# EAGLE design 4069 fuzz pedal (EAGLE 9.6.2)
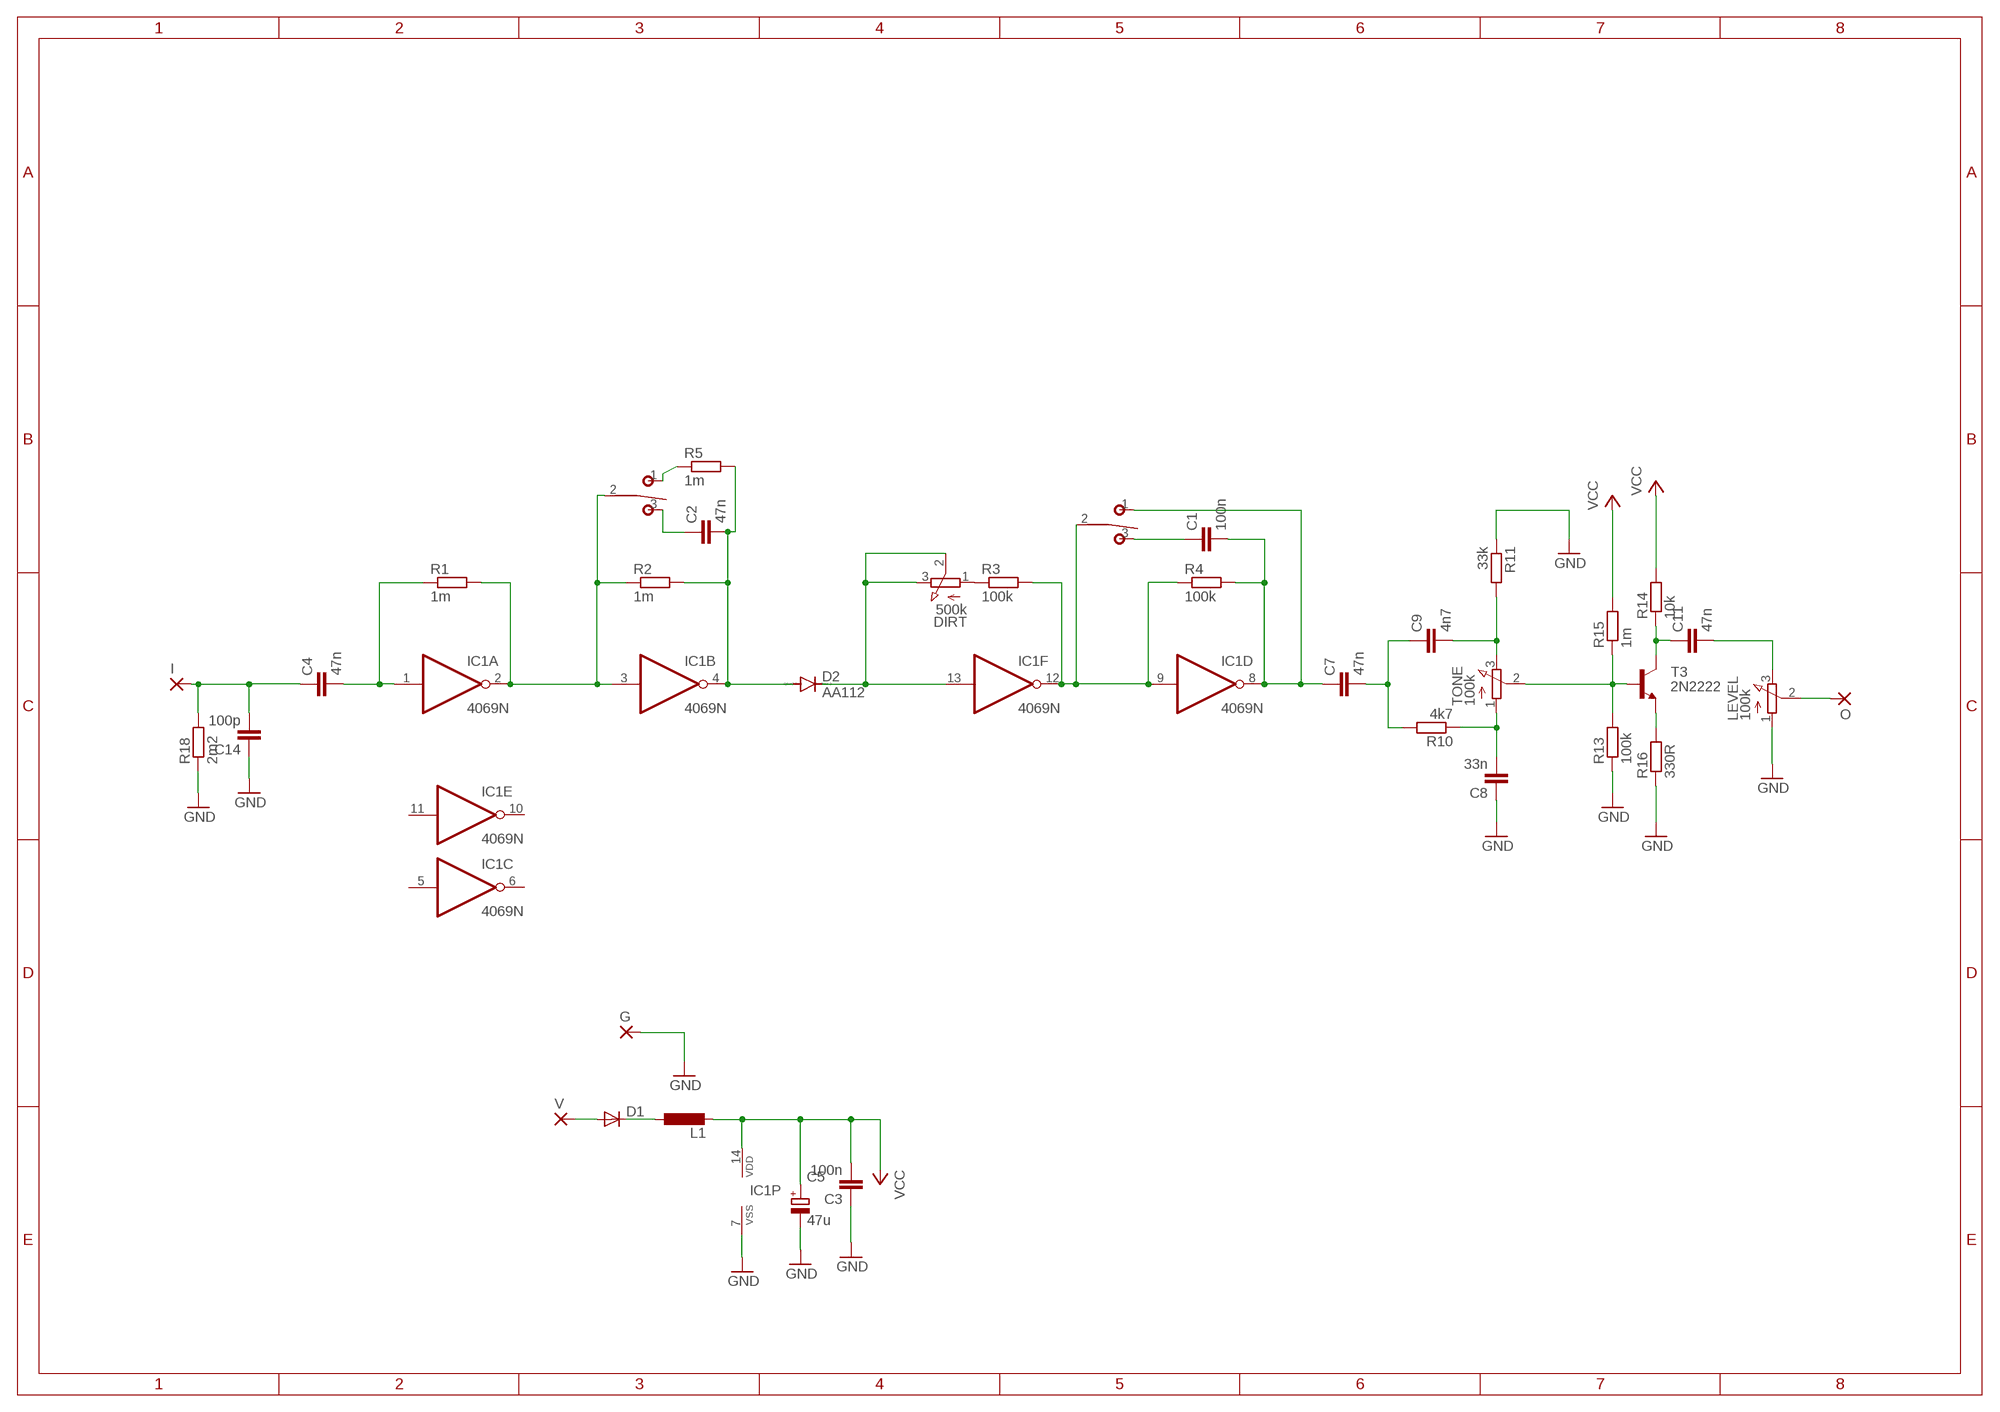
[diagram p0: schematic, sheet 1]

## Parts
C1  100n  C5/2.5  [C5B2.5]
C2  47n  C5/2.5  [C5B2.5]
C3  100n  C5/2.5  [C5B2.5]
C4  47n  C5/2.5  [C5B2.5]
C5  47u  CPOL-EUE2-4  [E2-4]
C7  47n  C5/2.5  [C5B2.5]
C8  33n  C5/2.5  [C5B2.5]
C9  4n7  C5/2.5  [C5B2.5]
C11  47n  C5/2.5  [C5B2.5]
C14  100p  C5/2.5  [C5B2.5]
D1  SMALL_DIODEDO35-7  [DO35-7]
D2  AA112  [DO07]
DIRT  500k  HEXPOT1  [3RP/1610N]
G  2,15/1,0  [2,15/1,0]
I  2,15/1,0  [2,15/1,0]
IC1  4069N  [DIL14]
L1  L-EU0204/7  [0204/7]
LEVEL  100k  HEXPOT1  [3RP/1610N]
O  2,15/1,0  [2,15/1,0]
R1  1m  R-EU_0207/7  [0207/7]
R2  1m  R-EU_0207/7  [0207/7]
R3  100k  R-EU_0207/7  [0207/7]
R4  100k  R-EU_0207/7  [0207/7]
R5  1m  R-EU_0207/7  [0207/7]
R10  4k7  R-EU_0207/7  [0207/7]
R11  33k  R-EU_0207/7  [0207/7]
R13  100k  R-EU_0207/7  [0207/7]
R14  10k  R-EU_0207/7  [0207/7]
R15  1m  R-EU_0207/7  [0207/7]
R16  330R  R-EU_0207/7  [0207/7]
R18  2m2  R-EU_0207/7  [0207/7]
T3  2N2222  [TO18]
TONE  100k  HEXPOT1  [3RP/1610N]
U$1  T-80-T-SPDT-ON-OFF-ON  [M9040P]
U$2  T-80-T-SPDT-ON-OFF-ON  [M9040P]
V  2,15/1,0  [2,15/1,0]

## Nets
GND: C3.1 C5.- C8.1 C14.1 G.1(P) IC1.7(P:VSS) LEVEL.1(A) R11.1 R13.1 R16.1 R18.1
N$1: C2.2 D2.A IC1.4(B:O) R2.2 R5.2
N$2: IC1.2(A:O) IC1.3(B:I) R1.2 R2.1 U$2.2(P)
N$3: DIRT.1(A) R3.1
N$4: IC1.9(D:I) IC1.12(F:O) R3.2 R4.1 U$1.2(P)
N$5: D2.C DIRT.2(S) DIRT.3(E) IC1.13(F:I)
N$6: C4.2 IC1.1(A:I) R1.1
N$7: C2.1 U$2.3(S)
N$8: C4.1 C14.2 I.1(P) R18.2
N$9: R5.1 U$2.1(O)
N$10: C1.1 U$1.3(S)
N$11: D1.C L1.1
N$12: D1.A V.1(P)
N$13: C9.2 R11.2 TONE.3(E)
N$16: C8.2 R10.1 TONE.1(A)
N$17: C7.2 C9.1 R10.2
N$19: R13.2 R15.1 T3.2(B) TONE.2(S)
N$20: C11.1 R14.1 T3.3(C)
N$21: R16.2 T3.1(E)
N$22: LEVEL.2(S) O.1(P)
N$23: C11.2 LEVEL.3(E)
N$25: C1.2 C7.1 IC1.8(D:O) R4.2 U$1.1(O)
VCC: C3.2 C5.+ IC1.14(P:VDD) L1.2 R14.2 R15.2
Unconnected: IC1.5(C:I) IC1.6(C:O) IC1.10(E:O) IC1.11(E:I)

## Library data of the parts
C1-C4 C7-C9 C11 C14 = hexcapacitor-wima:C: CAPACITOR naming: grid - package width
C5 = rcl:CPOL-EU: POLARIZED CAPACITOR, European symbol; SPICEPREFIX: C
D1 = MusicThingModular:SMALL_DIODE: Small Signal Diode
D2 = diode:AA112: DIODE germanium
DIRT LEVEL TONE = hexpedalpot:HEXPOT1: 16mm Potentiometer one level Source: http://www.alphapotentiometers.net/html/16mm_pot_2.html
G I O V = wirepad:2,15/1,0: THROUGH-HOLE PAD
IC1 = 40xx:4069: Hex INVERTER
L1 = hexresistor:L-EU: INDUCTOR, European symbol; SPICEPREFIX: L
R1-R5 R10 R11 R13-R16 R18 = hexresistor:R-EU_: RESISTOR, European symbol; SPICEPREFIX: R
T3 = transistor:2N2222: NPN TRANSISTOR
U$1 U$2 = MusicThingModular:T-80-T-SPDT-ON-OFF-ON

## Net classes
0 default: width 0.203 mm

## Board
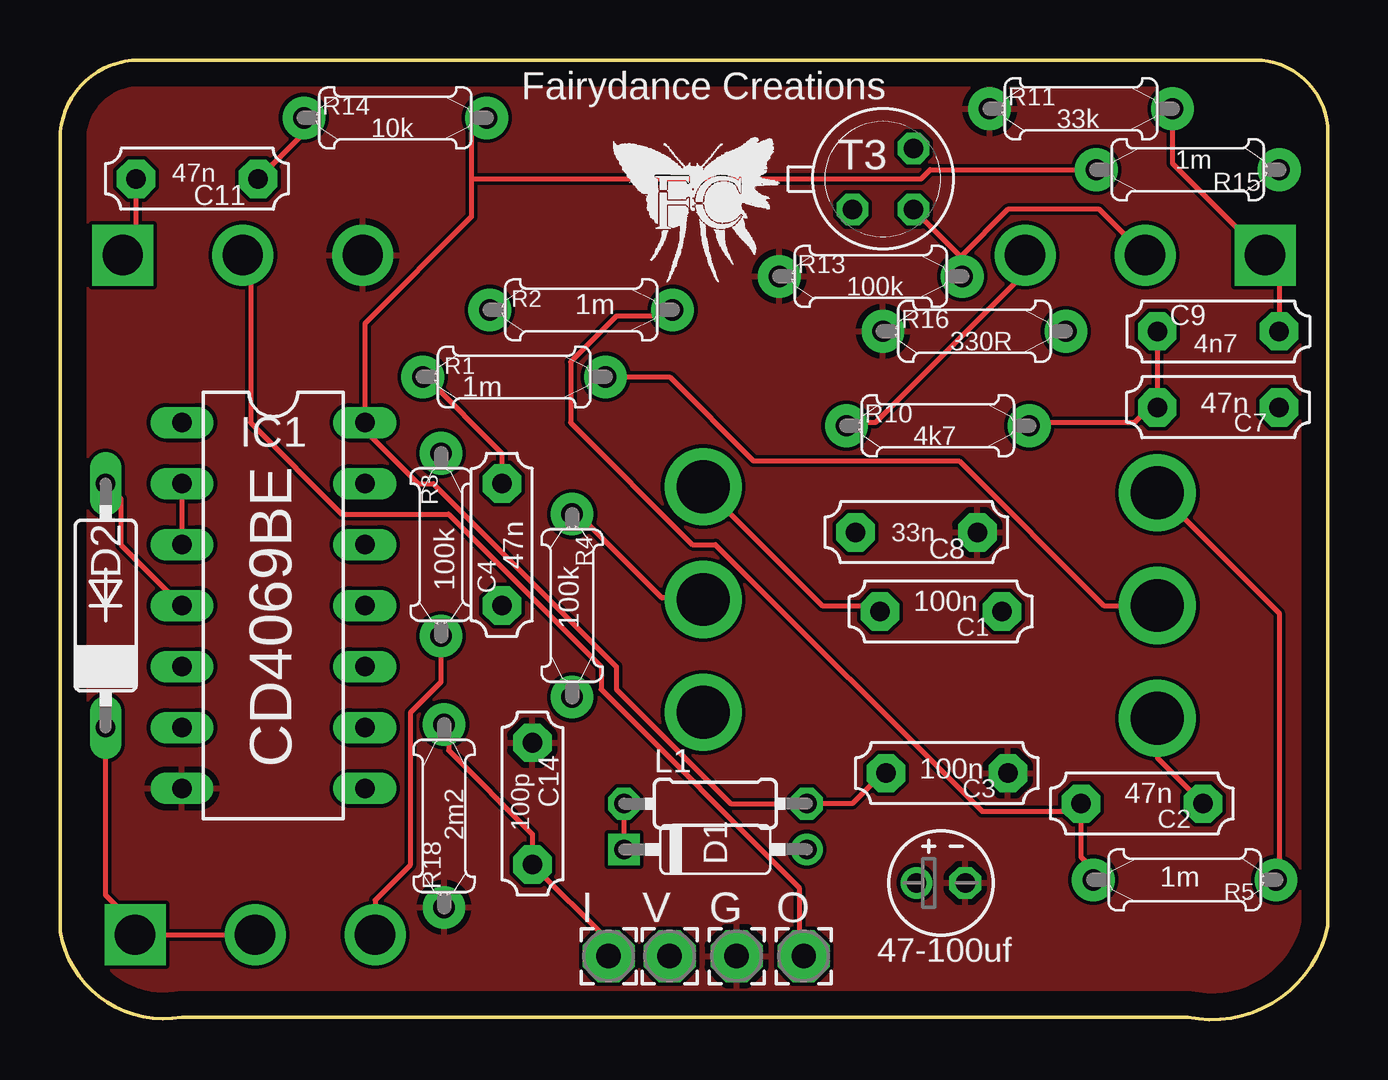
[diagram p1: board, top side]
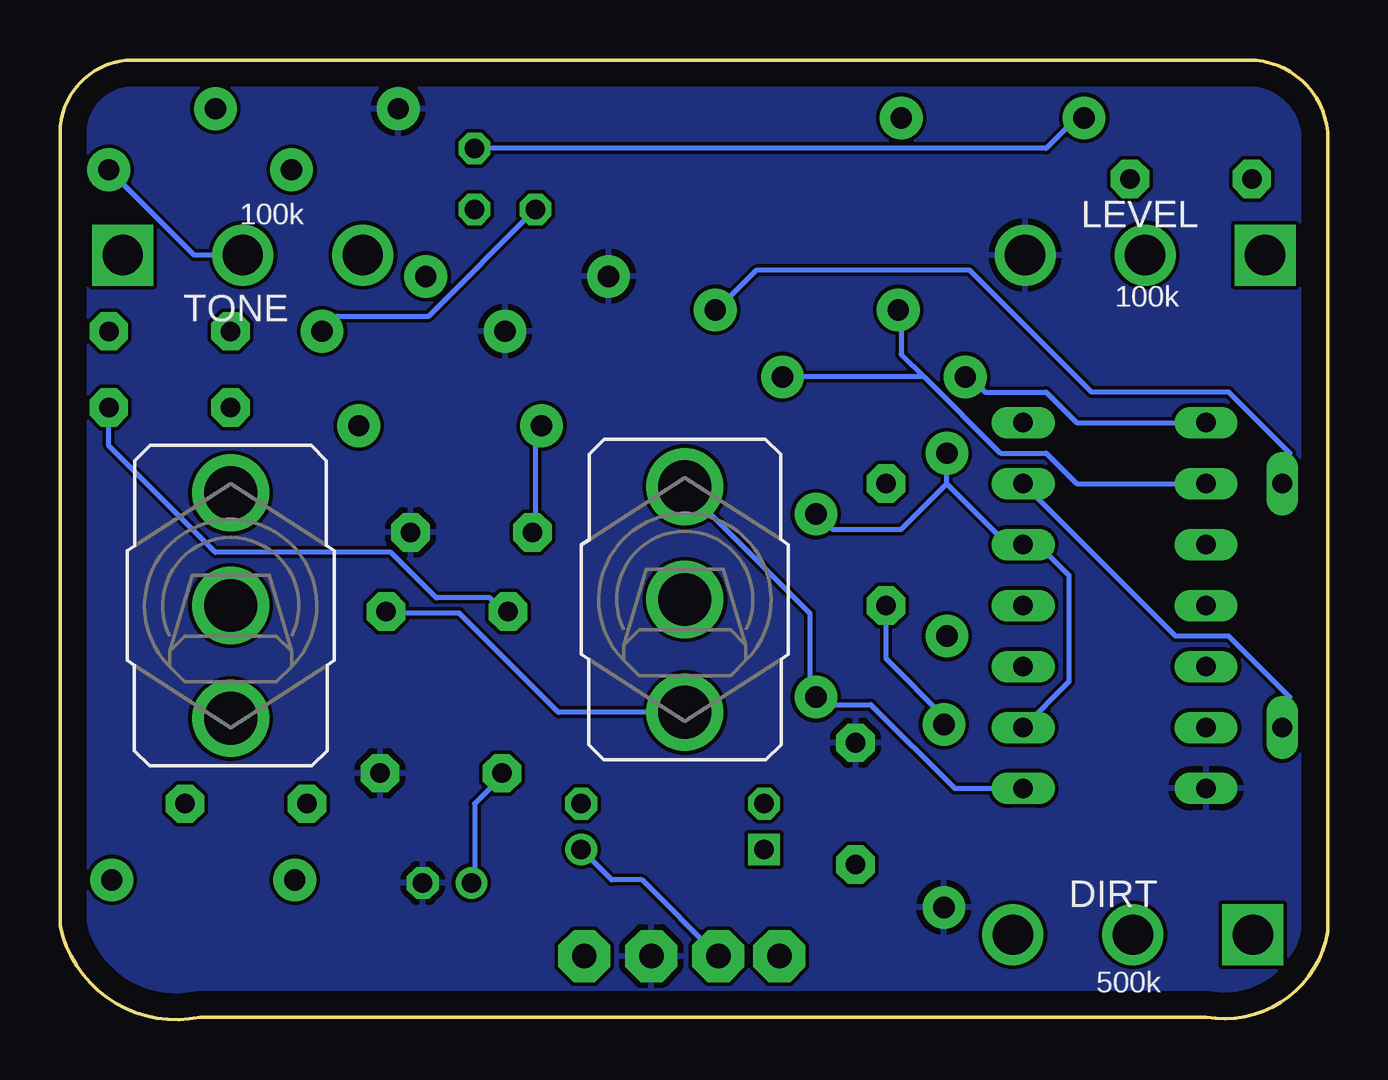
[diagram p2: board, bottom side, seen from below]

Size 52.83 x 39.98 mm. Coordinates in mm from the lower left corner, seen from the top.
Outline: 0,36.68 0,3.66 arc90 5.08,0.1 46.99,0.1 arc90 52.83,3.91 52.83,36.93 arc90 49.78,39.98 3.3,39.98 arc90 0,36.68
Copper layers (1*16): Top 0.035mm / dielectric 1.5mm / Bottom 0.035mm
Design rules "default": minimum track width 6mil, minimum drill 0.35mm, track to track 6mil, track to pad 6mil, pad to pad 6mil, via to via 6mil, smd to smd 6mil, copper to edge 40mil, drill to drill 6mil, minimum pad ring 10mil, minimum via ring 8mil, stop-mask expansion 4mil, vias tented up to drill 0mil, thermal gap 10mil

### Footprints (pad centres in the part's own frame; a part is rotated, then mirrored left to right if it is on the bottom)
C5B2.5 = drill 0.813 pad 1.6 octagon: 1 -2.54,0; 2 2.54,0
E2-4 = drill 0.813 pad 1.27: + -1.016,0 | drill 0.813 pad 1.27 octagon: - 1.016,0
DO35-7 = drill 0.813: A 3.81,0 | drill 0.813 square: C -3.81,0
DO07 = drill 0.813 long: A 5.08,0; C -5.08,0
3RP/1610N = drill 1.676 pad 2.54: 1 -5,0; 2 0,0 | drill 1.676 pad 2.54 square: 3 5,0
2,15/1,0 = drill 1.016 pad 2.159 octagon: 1 0,0
DIL14 = drill 0.813 long: 1 -7.62,-3.81; 2 -5.08,-3.81; 3 -2.54,-3.81; 4 0,-3.81; 5 2.54,-3.81; 6 5.08,-3.81; 7 7.62,-3.81; 8 7.62,3.81; 9 5.08,3.81; 10 2.54,3.81; 11 0,3.81; 12 -2.54,3.81; 13 -5.08,3.81; 14 -7.62,3.81
0204/7 = drill 0.813 octagon: 1 -3.81,0; 2 3.81,0
0207/7 = drill 0.889 pad 1.778: 1 -3.81,0; 2 3.81,0
TO18 = drill 0.813 octagon: 1 -1.27,-1.27; 2 1.27,-1.27; 3 1.27,1.27
M9040P = drill 2.2: 1 0,4.699 | drill 2.2 pad 3: 2 0,0; 3 0,-4.699

### Placement (x,y rotation side)
C1  36.7,17 180 top
C2  45.09,8.99 180 top
C3  36.96,10.26 180 top
C4  18.41,19.79 90 top
C5  36.7,5.69 0 top
C7  48.26,25.5 180 top
C8  35.69,20.3 180 top
C9  48.26,28.68 0 top
C11  5.72,35.03 180 top
C14  19.69,8.99 270 top
D1  27.3,7.09 0 top
D2  1.91,17.25 90 top
DIRT  8.13,3.53 0 bottom
G  28.19,2.64 0 top
I  22.86,2.64 0 top
IC1  8.89,17.25 270 top
L1  27.3,8.99 0 top
LEVEL  7.62,31.85 0 bottom
O  30.99,2.64 0 top
R1  18.92,26.77 0 top
R2  21.72,29.57 0 top
R3  15.88,19.79 90 top
R4  21.34,17.25 270 top
R5  46.86,5.82 180 top
R10  36.58,24.74 0 top
R11  42.55,37.95 0 top
R13  33.78,30.97 0 top
R14  13.97,37.57 0 top
R15  46.99,35.41 180 top
R16  38.1,28.68 0 top
R18  16,8.49 90 top
T3  34.29,35.03 0 top
TONE  45.21,31.85 180 bottom
U$1  26.8,17.5 0 bottom
U$2  45.72,17.25 0 bottom
V  25.4,2.64 0 top

### Tracks (layer width: path | path; a pad name or v marks a point on that pad's centre or on a via)
GND
  pour Bottom: -0.84,39.88 -0.84,0.16 52.73,0.16 52.73,39.88
  pour Top: -0.94,0.23 -0.94,39.93 53.44,39.93 53.44,0.23
N$1
  Top 0.203: 42.55,8.68 42.55,6.77 43.5,5.82 R5.2 | IC1.4 2.54,19.79 2.54,21.69 D2.A | 42.55,8.68 38.42,8.68 27.3,19.79 26.35,19.79 21.27,24.87 21.27,27.41 23.18,29.31 25.4,29.31 R2.2 | 42.55,8.68 C2.2
  Bottom 0.203: D2.A 1.59,22.65 1.59,23.6 4.13,26.14 9.84,26.14 14.92,31.22 23.81,31.22 25.4,29.63 R2.2
N$2
  Top 0.203: IC1.2 IC1.3 | U$2.2 43.5,17.25 37.47,23.28 28.89,23.28 25.4,26.77 R1.2
  Bottom 0.203: IC1.2 10.48,22.33 11.75,23.6 13.65,23.6 16.83,26.77 | 16.83,26.77 17.78,27.73 17.78,29.31 R2.1 | 16.83,26.77 R1.2
N$3
  Top 0.203: R3.1 15.88,14.07 14.61,12.8 14.61,6.45 13.13,4.98 DIRT.1
N$4
  Top 0.203: R4.1 21.59,21.06 25.08,17.57 26.67,17.57 U$1.2
  Bottom 0.203: IC1.9 10.8,14.07 10.8,18.52 12.07,19.79 IC1.12 13.34,19.79 15.88,22.33 | 15.88,22.33 R3.2 | 15.88,22.33 17.78,20.42 20.64,20.42 21.27,21.06 R4.1
N$5
  Top 0.203: D2.C 1.91,5.18 3.13,3.96 DIRT.3 DIRT.2
  Bottom 0.203: IC1.13 6.35,15.98 4.13,15.98 1.59,13.44 1.59,12.49 D2.C
N$6
  Top 0.203: C4.2 18.41,23.6 15.24,26.77 R1.1
  Bottom 0.203: IC1.1 10.48,24.87 11.75,26.14 14.29,26.14 14.92,26.77 R1.1
N$7
  Top 0.203: C2.1 45.72,10.9 U$2.3
N$8
  Top 0.203: I.1 22.86,3.28 C14.2 19.69,7.72 16.19,11.22 16.19,12.17 R18.2
  Bottom 0.203: C4.1 18.41,15.03 15.88,12.49 R18.2
N$9
  Top 0.203: R5.1 50.8,5.82 50.8,16.93 45.72,22.01 U$2.1
N$10
  Bottom 0.203: U$1.3 32.07,12.8 36.2,16.93 39.05,16.93 C1.1
N$11
  Top 0.203: L1.1 D1.C
N$12
  Bottom 0.203: D1.A 29.84,5.82 28.57,5.82 V.1
N$13
  Top 0.203: 50.8,31.22 50.8,31.85 TONE.3 50.22,31.8 | 50.8,31.22 C9.2 | R11.2 46.36,35.66 50.22,31.8 | 50.8,31.22 50.22,31.8
N$16
  Top 0.203: R10.1 33.02,24.87 33.97,24.87 40.96,31.85 TONE.1
  Bottom 0.203: C8.2 33.02,20.42 33.02,24.55 R10.1
N$17
  Top 0.203: C9.1 45.72,25.82 | 45.72,25.82 44.77,24.87 40.64,24.87 R10.2 | 45.72,25.82 C7.2
N$19
  Top 0.203: 37.53,31.79 37.78,31.54 37.4,31.16 R13.2 | 37.53,31.79 T3.2 | 37.53,31.79 39.5,33.76 43.31,33.76 TONE.2
  Bottom 0.203: R15.1 47.24,31.85 TONE.2
N$20
  Top 0.203: C11.1 10.16,36.93 R14.1
  Bottom 0.203: T3.3 11.75,36.3 10.48,37.57 R14.1
N$21
  Bottom 0.203: T3.1 37.47,29.31 41.27,29.31 R16.2
N$22
  Top 0.203: LEVEL.2 7.94,31.54 7.94,24.87 11.75,21.06 16.19,21.06 22.54,14.71 22.54,13.76 30.8,5.5 30.8,2.64 O.1
N$23
  Top 0.203: C11.2 3.17,32.17 2.86,31.85 LEVEL.3
N$25
  Top 0.203: U$1.1 31.75,17.25 33.97,17.25 C1.2
  Bottom 0.203: IC1.8 15.56,9.63 19.05,13.12 20.96,13.12 21.27,13.44 R4.2 21.59,13.44 21.59,16.93 26.67,22.01 U$1.1 | C7.1 50.8,23.92 46.36,19.47 39.05,19.47 37.15,17.57 34.93,17.57 34.29,16.93 C1.2
VCC
  Top 0.203: C3.2 34.29,10.26 33.02,8.99 L1.2 27.94,8.99 23.18,13.76 23.18,14.71 15.56,22.33 14.92,22.33 12.7,24.55 IC1.14 12.7,29 17.14,33.44 17.14,35.03 | 17.14,35.03 17.14,36.93 R14.2 | R15.2 36.26,35.41 35.88,35.03 17.14,35.03
  Bottom 0.203: C5.+ 35.56,5.82 35.56,8.99 34.29,10.26 C3.2

### Text on the board
tNames: Fairydance Creations | CD4069BE | 47-100uf